# Altium schematic sheet Components part1.SchDoc
size A
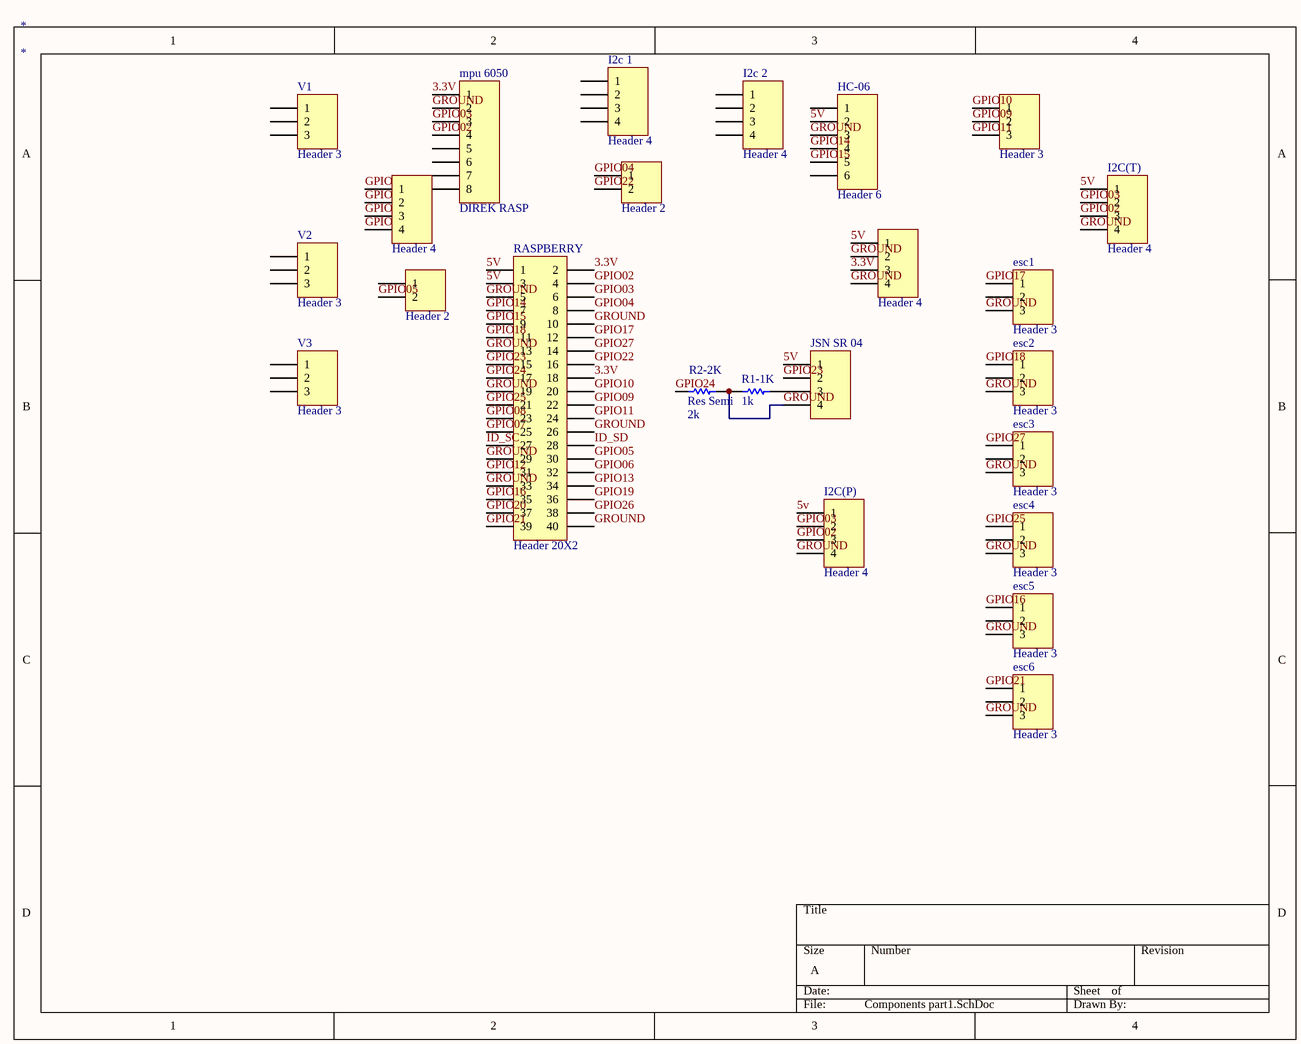
[diagram p0: Components part1.SchDoc]

## Parts
*  *
esc1  Header 3  [HDR1X3]
esc2  Header 3  [HDR1X3]
esc3  Header 3  [HDR1X3]
esc4  Header 3  [HDR1X3]
esc5  Header 3  [HDR1X3]
esc6  Header 3  [HDR1X3]
Extra2  Header 4  [HDR1X4]
EXTRA_0  Header 4  [HDR1X4]
EXTRA_2  Header 2  [HDR1X2]
EXTRA_3  Header 3  [HDR1X3]
EXTRA_5  Header 2  [HDR1X2]
HC-06  Header 6  [HDR1X6]
I2C(P)  Header 4  [HDR1X4]
I2C(T)  Header 4  [HDR1X4]
I2c_1  Header 4  [HDR1X4]
I2c_2  Header 4  [HDR1X4]
JSN_SR_04  (no value)  [HDR1X4]
mpu_6050  DIREK RASP  [HDR1X8]
R1-1K  1k  [AXIAL-0.5]
R2-2K  Res Semi  value 2k  [AXIAL-0.5]
RASPBERRY  Header 20X2  [HDR2X20]
V1  Header 3  [HDR1X3]
V2  Header 3  [HDR1X3]
V3  Header 3  [HDR1X3]

## Nets
3.3V: Extra2.3 mpu_6050.1 RASPBERRY.2 RASPBERRY.18
5v: Extra2.1 HC-06.2 I2C(P).1 I2C(T).1 JSN_SR_04.1 RASPBERRY.1 RASPBERRY.3
GPIO02: I2C(P).3 I2C(T).3 mpu_6050.4 RASPBERRY.4
GPIO03: I2C(P).2 I2C(T).2 mpu_6050.3 RASPBERRY.6
GPIO04: EXTRA_2.1 RASPBERRY.8
GPIO05: EXTRA_5.2 RASPBERRY.30
GPIO06: EXTRA_0.1 RASPBERRY.32
GPIO07: RASPBERRY.25
GPIO08: RASPBERRY.23
GPIO09: EXTRA_3.2 RASPBERRY.22
GPIO10: EXTRA_3.1 RASPBERRY.20
GPIO11: EXTRA_3.3 RASPBERRY.24
GPIO12: RASPBERRY.31
GPIO13: EXTRA_0.2 RASPBERRY.34
GPIO14: HC-06.4 RASPBERRY.7
GPIO15: HC-06.5 RASPBERRY.9
GPIO16: esc5.1 RASPBERRY.35
GPIO17: esc1.1 RASPBERRY.12
GPIO18: esc2.1 RASPBERRY.11
GPIO19: EXTRA_0.3 RASPBERRY.36
GPIO20: RASPBERRY.37
GPIO21: esc6.1 RASPBERRY.39
GPIO22: EXTRA_2.2 RASPBERRY.16
GPIO23: JSN_SR_04.2 RASPBERRY.15
GPIO24: R2-2K.1 RASPBERRY.17
GPIO25: esc4.1 RASPBERRY.21
GPIO26: EXTRA_0.4 RASPBERRY.38
GPIO27: esc3.1 RASPBERRY.14
GROUND: esc1.3 esc2.3 esc3.3 esc4.3 esc5.3 esc6.3 Extra2.2 Extra2.4 HC-06.3 I2C(P).4 I2C(T).4 JSN_SR_04.4 mpu_6050.2 R1-1K.1 R2-2K.2 RASPBERRY.5 RASPBERRY.10 RASPBERRY.13 RASPBERRY.19 RASPBERRY.26 RASPBERRY.29 RASPBERRY.33 RASPBERRY.40
ID_SC: RASPBERRY.27
ID_SD: RASPBERRY.28
NetJSN_SR_04_3: JSN_SR_04.3 R1-1K.2

Not connected (* = marked no-connect by the designer): esc1 2; esc2 2; esc3 2; esc4 2; esc5 2; esc6 2; EXTRA_5 1; HC-06 1 6; I2c_1 1 2 3 4; I2c_2 1 2 3 4; mpu_6050 5 6 7 8; V1 1 2 3; V2 1 2 3; V3 1 2 3

## Library data of the parts
* = rerere
esc1-esc6 EXTRA_3 V1-V3 = Header 3: Header, 3-Pin; LatestRevisionDate: 17-Jul-2002; LatestRevisionNote: Re-released for DXP Platform.; Publisher: Altium Limited
Extra2 EXTRA_0 I2C(P) I2C(T) I2c_1 I2c_2 JSN_SR_04 = Header 4: Header, 4-Pin; LatestRevisionDate: 17-Jul-2002; LatestRevisionNote: Re-released for DXP Platform.; Publisher: Altium Limited
EXTRA_2 EXTRA_5 = Header 2: Header, 2-Pin; LatestRevisionDate: 17-Jul-2002; LatestRevisionNote: Re-released for DXP Platform.; Publisher: Altium Limited
HC-06 = Header 6: Header, 6-Pin; LatestRevisionDate: 17-Jul-2002; LatestRevisionNote: Re-released for DXP Platform.; Publisher: Altium Limited
mpu_6050 = Header 8: Header, 8-Pin; LatestRevisionDate: 17-Jul-2002; LatestRevisionNote: Re-released for DXP Platform.; Publisher: Altium Limited
R1-1K R2-2K = Res Semi: Semiconductor Resistor; Published: 8-Jun-2000; LatestRevisionDate: 17-Jul-2002; LatestRevisionNote: Re-released for DXP Platform.; PackageReference: AXIAL-0.5; Publisher: Altium Limited; PackageDescription: Axial Device, Thru-Hole; 2 Leads; 0.5 in Pin Spacing
  R1-1K: Value: 1K
RASPBERRY = Header 20X2: Header, 20-Pin, Dual row; LatestRevisionDate: 17-Jul-2002; LatestRevisionNote: Re-released for DXP Platform.; Publisher: Altium Limited